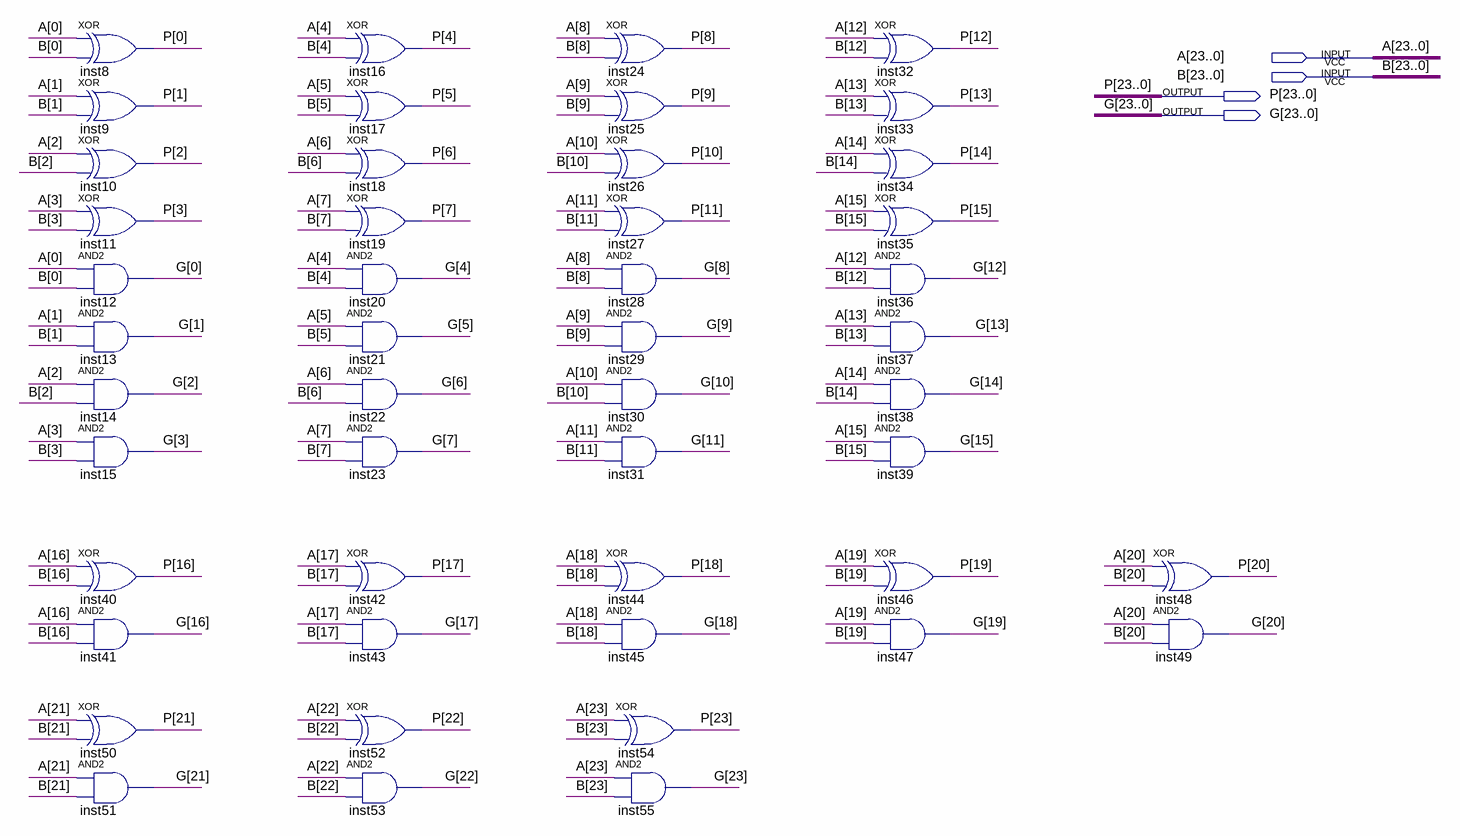
[diagram p0: schematic sheet]
// Quartus schematic cond24.bdf as structural Verilog: 48 symbols, 4 pins
module cond24 (
  input  [23:0] A,
  input  [23:0] B,
  output [23:0] P,
  output [23:0] G
);

  xor inst8 (P[0], A[0], B[0]);
  xor inst9 (P[1], A[1], B[1]);
  xor inst10 (P[2], A[2], B[2]);
  xor inst11 (P[3], A[3], B[3]);
  and inst12 (G[0], A[0], B[0]);
  and inst13 (G[1], A[1], B[1]);
  and inst14 (G[2], A[2], B[2]);
  and inst15 (G[3], A[3], B[3]);
  xor inst40 (P[16], A[16], B[16]);
  and inst41 (G[16], A[16], B[16]);
  xor inst50 (P[21], A[21], B[21]);
  and inst51 (G[21], A[21], B[21]);
  xor inst16 (P[4], A[4], B[4]);
  xor inst17 (P[5], A[5], B[5]);
  xor inst18 (P[6], A[6], B[6]);
  xor inst19 (P[7], A[7], B[7]);
  and inst20 (G[4], A[4], B[4]);
  and inst21 (G[5], A[5], B[5]);
  and inst22 (G[6], A[6], B[6]);
  and inst23 (G[7], A[7], B[7]);
  xor inst42 (P[17], A[17], B[17]);
  and inst43 (G[17], A[17], B[17]);
  xor inst52 (P[22], A[22], B[22]);
  and inst53 (G[22], A[22], B[22]);
  xor inst24 (P[8], A[8], B[8]);
  xor inst25 (P[9], A[9], B[9]);
  xor inst26 (P[10], A[10], B[10]);
  xor inst27 (P[11], A[11], B[11]);
  and inst28 (G[8], A[8], B[8]);
  and inst29 (G[9], A[9], B[9]);
  and inst30 (G[10], A[10], B[10]);
  and inst31 (G[11], A[11], B[11]);
  xor inst44 (P[18], A[18], B[18]);
  and inst45 (G[18], A[18], B[18]);
  xor inst54 (P[23], A[23], B[23]);
  and inst55 (G[23], A[23], B[23]);
  xor inst32 (P[12], A[12], B[12]);
  xor inst33 (P[13], A[13], B[13]);
  xor inst34 (P[14], A[14], B[14]);
  xor inst35 (P[15], A[15], B[15]);
  and inst36 (G[12], A[12], B[12]);
  and inst37 (G[13], A[13], B[13]);
  and inst38 (G[14], A[14], B[14]);
  and inst39 (G[15], A[15], B[15]);
  xor inst46 (P[19], A[19], B[19]);
  and inst47 (G[19], A[19], B[19]);
  xor inst48 (P[20], A[20], B[20]);
  and inst49 (G[20], A[20], B[20]);
endmodule
